# EAGLE design hot-wand-lite (EAGLE 7.6.0)
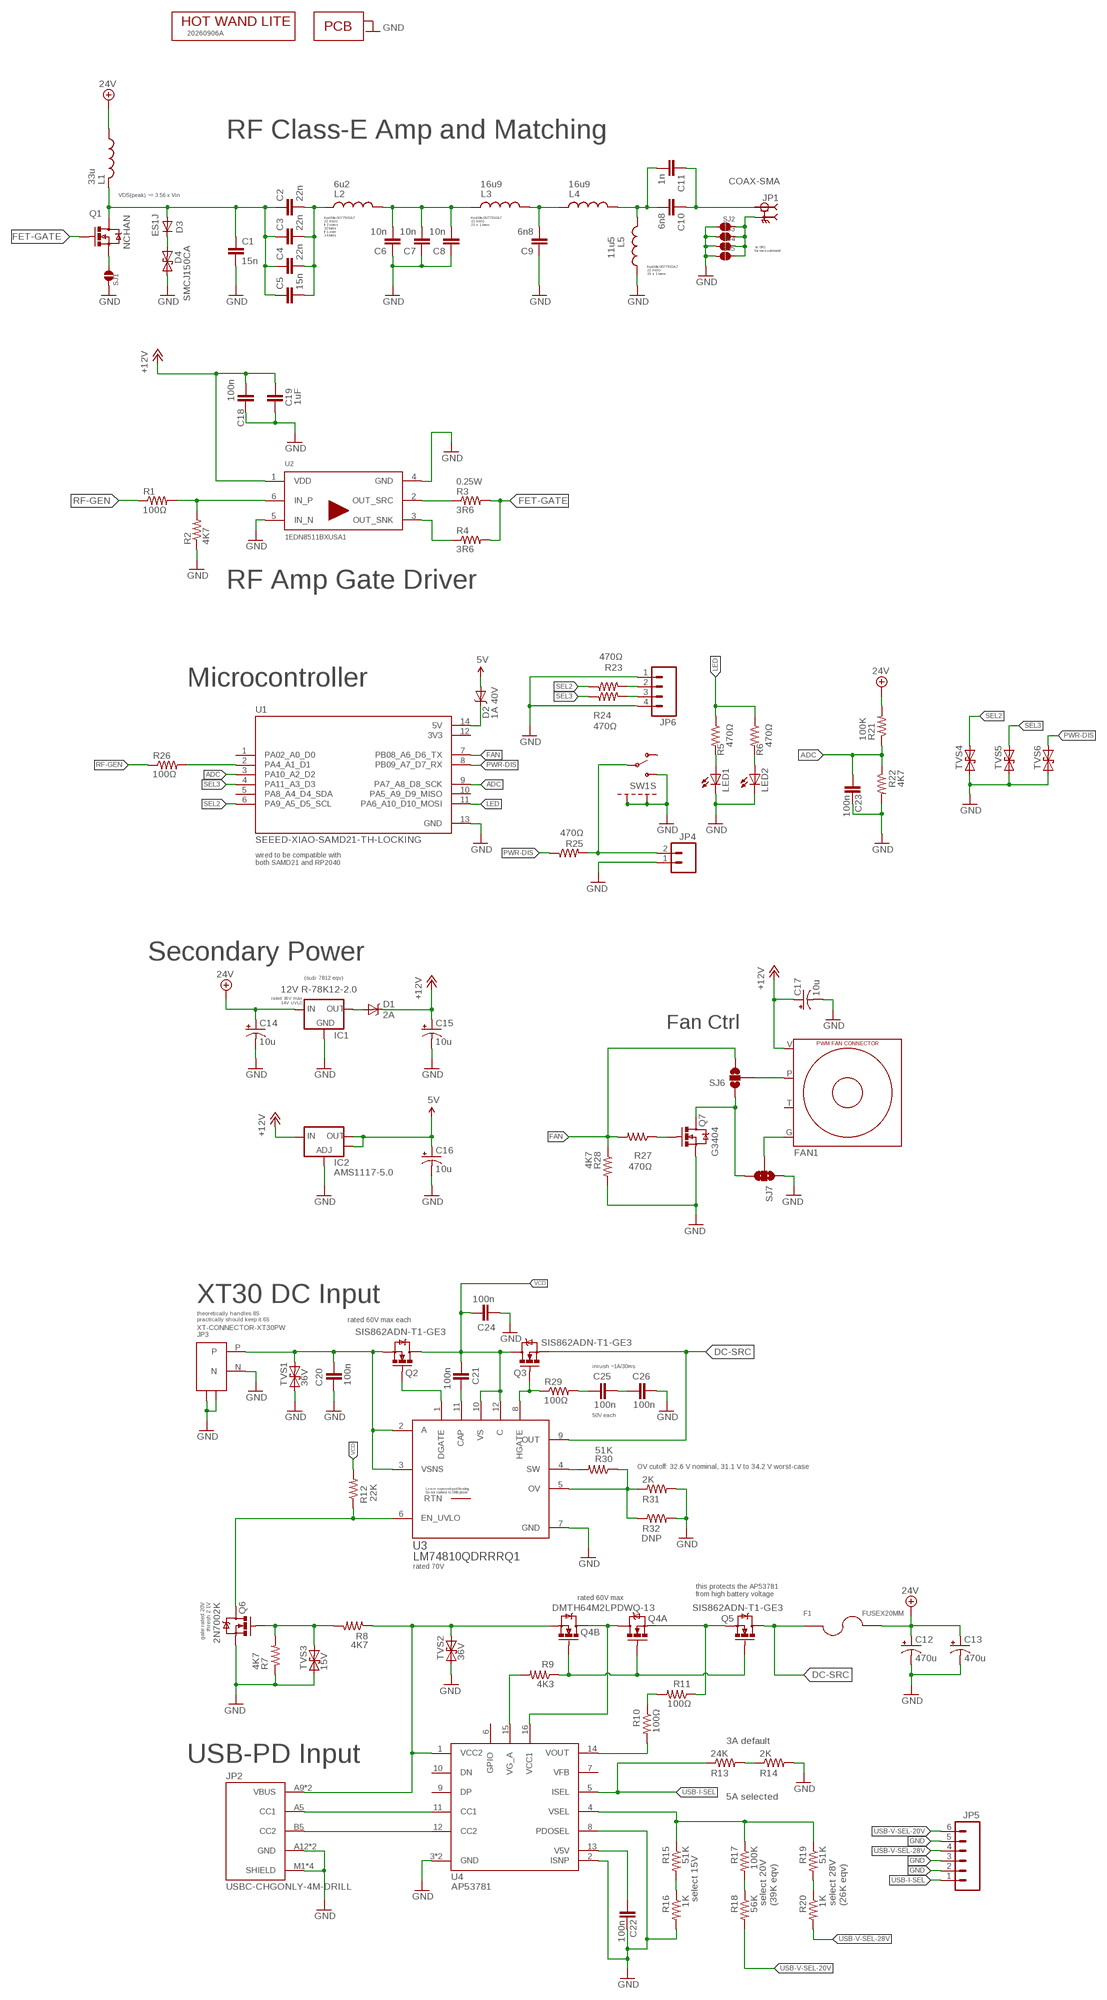
[diagram p0: schematic, sheet 1]

## Parts
C1  15n  CAP1206  [1206]
C2  22n  CAP1206  [1206]
C3  22n  CAP1206  [1206]
C4  22n  CAP1206  [1206]
C5  15n  CAP1206  [1206]
C6  10n  CAP1206  [1206]
C7  10n  CAP1206  [1206]
C8  10n  CAP1206  [1206]
C9  6n8  CAP1206  [1206]
C10  6n8  CAP1206  [1206]
C11  1n  CAP1206  [1206]
C12  470u  CAP_POLPTH5  [CPOL-RADIAL-COMBO-10MM]
C13  470u  CAP_POLPTH5  [CPOL-RADIAL-COMBO-10MM]
C14  10u  CAP_POL1206-KIT  [EIA3216-KIT]
C15  10u  CAP_POL1206-KIT  [EIA3216-KIT]
C16  10u  CAP_POL1206-KIT  [EIA3216-KIT]
C17  10u  CAP_POL1206-KIT  [EIA3216-KIT]
C18  100n  CAP0603-CAP  [0603-CAP]
C19  1uF  CAP0603-CAP  [0603-CAP]
C20  100n  CAP0603-CAP  [0603-CAP]
C21  100n  CAP0603-CAP  [0603-CAP]
C22  100n  CAP0603-CAP  [0603-CAP]
C23  100n  CAP0603-CAP  [0603-CAP]
C24  100n  CAP0603-CAP  [0603-CAP]
C25  100n  CAP0603-CAP  [0603-CAP]
C26  100n  CAP0603-CAP  [0603-CAP]
D1  2A  DIODE-SCHOTTKY_  [SMA-DIODE]
D2  1A 40V  DIODE-SCHOTTKYSOD123FL  [SOD123FL]
D3  ES1J  DIODESMA  [SMA-DIODE]
D4  SMCJ150CA  TVSSMC  [SMC]
F1  FUSEX20MM  [FUSE_5MM]
FAN1  FAN-CONN-X4-CONN-X4  [FAN-CONN-X4]
IC1  12V R-78K12-2.0  V_REG_78XX-BUCK  [TO220-BUCK-12V]
IC2  AMS1117-5.0  V_REG_LM1117SOT223  [SOT223]
JP1  COAX-SMA  COAX-SMA-EDGE-LGRPAD  [SAMTEC_SMA-J-P-H-ST-EM1-LGRPAD]
JP2  USBC-CHGONLY-4M-DRILL  [SAMESKY_UJC-H-G-SMT-2-P6-TR-DRILL]
JP3  XT-CONNECTOR-XT30PW  [XT30PW]
JP4  M02PTH3  [1X02_LONGPADS]
JP5  M06LOCK  [1X06_LOCK]
JP6  M04LOCK  [1X04_LOCK]
L1  33u  INDUCTOR-SRP1265A  [IND_SRP1265A]
L2  6u2  INDUCTOR-KOOLMU-2W  [IND-KOOLMU-2W]
L3  16u9  INDUCTOR-KOOLMU  [IND-KOOLMU]
L4  16u9  INDUCTOR-KOOLMU  [IND-KOOLMU]
L5  11u5  INDUCTOR-KOOLMU  [IND-KOOLMU]
LED1  LED  LED-LTST-S220KRKT  [LED_LTST-S220KRKT]
LED2  LED  LED0603  [LED-0603]
PCB1  PCB-OUTLINE  [PCB-OUTLINE]
PCB2  PCB-ART-VER-LITE  [PCB-ART-VERSION-LITE]
Q1  NCHAN  MOSFET-NCHANNEL-TO247-COMBO  [TO247-COMBO]
Q2  SIS862ADN-T1-GE3  MOSFET-NCHANNEL-POWERPAK1212-8  [POWERPAK-1212-8]
Q3  SIS862ADN-T1-GE3  MOSFET-NCHANNEL-POWERPAK1212-8  [POWERPAK-1212-8]
Q4  DMTH64M2LPDWQ-13  MOSFET-NCHAN-X2-PPSO8X2  [POWERPAK-SO8-X2]
Q5  SIS862ADN-T1-GE3  MOSFET-NCHANNEL-POWERPAK1212-8  [POWERPAK-1212-8]
Q6  2N7002K  MOSFET-NCHANNELSMD  [SOT23-3]
Q7  G3404  MOSFET-NCHANNELSMD  [SOT23-3]
R1  100Ω  RESISTOR0805-RES  [0805]
R2  4K7  RESISTOR0603-RES  [0603-RES]
R3  3R6  RESISTOR0603-RES  [0603-RES]
R4  3R6  RESISTOR0603-RES  [0603-RES]
R5  470Ω  RESISTOR0603-RES  [0603-RES]
R6  470Ω  RESISTOR0603-RES  [0603-RES]
R7  4K7  RESISTOR0603-RES  [0603-RES]
R8  4K7  RESISTOR0603-RES  [0603-RES]
R9  4K3  RESISTOR0603-RES  [0603-RES]
R10  100Ω  RESISTOR0805-RES  [0805]
R11  100Ω  RESISTOR0805-RES  [0805]
R12  22K  RESISTOR0603-RES  [0603-RES]
R13  24K  RESISTOR0603-RES  [0603-RES]
R14  2K  RESISTOR0603-RES  [0603-RES]
R15  51K  RESISTOR0603-RES  [0603-RES]
R16  1K  RESISTOR0603-RES  [0603-RES]
R17  100K  RESISTOR0603-RES  [0603-RES]
R18  56K  RESISTOR0603-RES  [0603-RES]
R19  51K  RESISTOR0603-RES  [0603-RES]
R20  1K  RESISTOR0603-RES  [0603-RES]
R21  100K  RESISTOR0603-RES  [0603-RES]
R22  4K7  RESISTOR0603-RES  [0603-RES]
R23  470Ω  RESISTOR0603-RES  [0603-RES]
R24  470Ω  RESISTOR0603-RES  [0603-RES]
R25  470Ω  RESISTOR0603-RES  [0603-RES]
R26  100Ω  RESISTOR0805-RES  [0805]
R27  470Ω  RESISTOR0603-RES  [0603-RES]
R28  4K7  RESISTOR0603-RES  [0603-RES]
R29  100Ω  RESISTOR0805-RES  [0805]
R30  51K  RESISTOR0603-RES  [0603-RES]
R31  2K  RESISTOR0603-RES  [0603-RES]
R32  DNP  RESISTOR0603-RES  [0603-RES]
SJ1  SJ-SMALL-1206-SJ  [1206-SJ]
SJ2  SJ-SMALL-1206-SJ  [1206-SJ]
SJ3  SJ-SMALL-1206-SJ  [1206-SJ]
SJ4  SJ-SMALL-1206-SJ  [1206-SJ]
SJ5  SJ-SMALL-1206-SJ  [1206-SJ]
SJ6  SOLDERJUMPER_2WAYS  [SJ_3]
SJ7  SOLDERJUMPER_2WAYS  [SJ_3]
SW1  SWITCH-SPDT-2MNT-SLW-864574-5A-RA-N-D  [SWITCH-SLW-864574-5A-RA-N-D]
TVS1  36V  TVSSMA  [SMA]
TVS2  36V  TVSSMA  [SMA]
TVS3  15V  TVSSOD-323  [SOD-323]
TVS4  TVSSOD323-R  [SOD323-R]
TVS5  TVSSOD323-R  [SOD323-R]
TVS6  TVSSOD323-R  [SOD323-R]
U1  SEEED-XIAO-SAMD21-TH-LOCKING  [MODULE_102010388_LOCKING]
U2  1EDN8511BXUSA1  1EDN8511B  [SOT95P280X145-6N-7-V]
U3  LM74810QDRRRQ1  [DRR0012E-MFG]
U4  AP53781  AP53781-QFN3030-16  [QFN3030-16]

## Nets
5V: C16.A(+) D2.A IC2.2(OUT) IC2.4(OUT)
12V-2: D1.A IC1.3(OUT)
+12V: C15.A(+) C17.A(+) C18.2 C19.2 D1.C FAN1.V IC2.3(IN) U2.1(VDD)
+24V: C12.1(+) C12.1B(+) C13.1(+) C13.1B(+) C14.A(+) F1.3 F1.4 IC1.1(IN) L1.1 R21.2 ; supply symbol labelled 24V
ADC: C23.2 R21.1 R22.1 U1.3(PA10_A2_D2) U1.9(PA7_A8_D8_SCK)
DC-SRC: F1.1 F1.2 Q3.1(S) Q3.2(S) Q3.3(S) Q5.5(D) Q5.6(D) Q5.7(D) Q5.8(D) Q5.9(D) U3.9(OUT)
FAN: R27.2 R28.1 SJ6.3 U1.7(PB08_A6_D6_TX)
FET-GATE: Q1.1(G) Q1.1B(G) R3.2 R4.2
GND: C1.2 C6.1 C7.1 C8.1 C9.1 C12.2(-) C12.2B(-) C13.2(-) C13.2B(-) C14.C(-) C15.C(-) C16.C(-) C17.C(-) C18.1 C19.1 C20.2 C22.1 C23.1 C24.2 C26.1 D4.A IC1.2(GND) IC2.1(ADJ) JP2.A12(GND) JP2.B12(GND) JP2.M1(SHIELD) JP2.M2(SHIELD) JP2.M3(SHIELD) JP2.M4(SHIELD) JP3.M1 JP3.M2 JP3.N JP4.1 JP5.2 JP5.3 JP5.5 JP6.1 JP6.4 L5.1 LED1.C LED2.C PCB1.1 PCB1.2 PCB1.3 PCB1.4 Q6.2(S) Q7.2(S) R2.1 R7.1 R14.2 R16.2 R22.2 R28.2 R31.2 R32.2 SJ1.1 SJ2.2 SJ3.2 SJ4.2 SJ5.2 SJ7.1 SW1.M1(M:MNT1) SW1.M2(M:MNT2) SW1.R(S:S) TVS1.A TVS2.A TVS3.2 TVS4.A TVS5.A TVS6.A U1.13(GND) U2.4(GND) U2.5(IN_N) U3.7(GND) U4.2(ISNP) U4.3(GND) U4.8(PDOSEL) U4.EXP(GND)
LED: R5.1 R6.1 U1.11(PA6_A10_D10_MOSI)
M1: C2.2 C3.2 C4.2 C5.2 L2.1A L2.1B L2.1C L2.1D
M2: C6.2 C7.2 C8.2 L2.2A L2.2B L2.2C L2.2D L3.1
M3: C9.2 L3.2 L4.1
M4: C10.2 C11.2 L4.2 L5.2
MCU-RF: R1.2 R2.2 U2.6(IN_P)
MOSFET-DRAIN: C1.1 C2.1 C3.1 C4.1 C5.1 D3.A L1.2 Q1.2(D)
MOSFET-SOURCE: Q1.3(S) Q1.3B(S) SJ1.2
N$2: R17.2 R18.1
N$3: SW1.L(S:O)
N$8: LED2.A R6.2
N$9: R15.2 R16.1
N$10: R13.2 R14.1
N$13: R19.2 R20.1
N$14: R3.1 U2.2(OUT_SRC)
N$15: R4.1 U2.3(OUT_SNK)
N$16: Q4.1(A:S) Q5.1(S) Q5.2(S) Q5.3(S) R11.1
N$17: JP6.2 R23.2
N$18: JP6.3 R24.2
N$19: Q7.1(G) R27.1
N$20: FAN1.P SJ6.2
N$21: JP4.2 R25.2 SW1.C(S:P)
N$22: Q7.3(D) SJ6.1 SJ7.3
N$23: D2.C U1.14(5V)
N$24: FAN1.G SJ7.2
N$25: D3.C D4.C
N$29: C25.1 C26.2
N$30: Q6.1(G) R7.2 R8.2 TVS3.1
N$35: Q4.5(B:D) Q4.6(B:D) Q4.7(A:D) Q4.8(A:D) Q4.9(B:D) Q4.10(A:D) U4.16(VCC1)
N$38: C22.2 U4.13(V5V)
N$40: R10.2 U4.14(VOUT)
N$43: C25.2 R29.2
N$46: LED1.A R5.2
N$57: R10.1 R11.2
N$68: R30.2 U3.4(SW)
N$69: C21.1 U3.11(CAP)
PWR-DIS: R25.1 TVS6.C U1.8(PB09_A7_D7_RX)
RF-GEN: R1.1 R26.1
RF-GEN-PRE: R26.2 U1.2(PA4_A1_D1)
RF-OUT: C10.1 C11.1 JP1.1
RF-RETURN: JP1.2_1 JP1.2_2 JP1.3_1 JP1.3_2 SJ2.1 SJ3.1 SJ4.1 SJ5.1
SEL2: R23.1 TVS4.C U1.6(PA9_A5_D5_SCL)
SEL3: R24.1 TVS5.C U1.4(PA11_A3_D3)
U3-DGATE: Q2.4(G) U3.1(DGATE)
U3-EN: Q6.3(D) R12.1 U3.6(EN_UVLO)
U3-HGATE: Q3.4(G) R29.1 U3.8(HGATE)
U3-OV: R30.1 R31.1 R32.1 U3.5(OV)
U4-VGA: R9.2 U4.15(VG_A)
U4-VGA-2: Q4.2(A:G) Q4.4(B:G) Q5.4(G) R9.1
U4-VSEL: R15.1 R17.1 R19.1 U4.4(VSEL)
USB-CC1: JP2.A5(CC1) U4.11(CC1)
USB-CC2: JP2.B5(CC2) U4.12(CC2)
USB-I-SEL: JP5.1 R13.1 U4.5(ISEL)
USB-V-SEL-20V: JP5.6 R18.2
USB-V-SEL-28V: JP5.4 R20.2
USB-VBUS: JP2.A9(VBUS) JP2.B9(VBUS) Q4.3(B:S) R8.1 TVS2.C U4.1(VCC2)
VCD: C21.2 C24.1 Q2.5(D) Q2.6(D) Q2.7(D) Q2.8(D) Q2.9(D) Q3.5(D) Q3.6(D) Q3.7(D) Q3.8(D) Q3.9(D) R12.2 U3.10(VS) U3.12(C)
VIN-XT30: C20.1 JP3.P Q2.1(S) Q2.2(S) Q2.3(S) TVS1.C U3.2(A) U3.3(VSNS)
Unconnected: FAN1.T U1.1(PA02_A0_D0) U1.5(PA8_A4_D4_SDA) U1.10(PA5_A9_D9_MISO) U3.13(RTN) U4.6(GPIO) U4.7(VFB) U4.9(DP) U4.10(DN)

## Notes on the sheet
- RF Class-E Amp and Matching
- VDS(peak) ~= 3.56 x Vin
- Kool Mu 0077932A7
  22 AWG
  if 2 cores
  10 turns
  if 1 core
  14 turns
- Kool Mu 0077932A7
  22 AWG
  23 ± 1 turns
- 4x 0R1
  for measurement
- Kool Mu 0077932A7
  22 AWG
  19 ± 1 turns
- 0.25W
- RF Amp Gate Driver
- Microcontroller
- wired to be compatible with
  both SAMD21 and RP2040
- Secondary Power
- (sub: 7812 eqv)
- rated 36V max
  14V UVLO
- Fan Ctrl
- XT30 DC Input
- theoretically handles 8S
  practically should keep it 6S
- rated 60V max each
- inrush ~1A/30ms
- 50V each
- OV cutoff: 32.6 V nominal, 31.1 V to 34.2 V worst-case
- rated 70V
- this protects the AP53781
  from high battery voltage
- rated 60V max
- gate rated 20V
  thresh 2.1V
- 3A default
- USB-PD Input
- 5A selected
- select 15V
- select 20V
  (39K eqv)
- select 28V
  (26K eqv)

## Power pins joined to a net without a drawn wire
3V3: U1.12(3V3)

## Library data of the parts
C1 C5 = hot-wand:CAP: Capacitor Standard 0603 ceramic capacitor, and 0.1" leaded capacitor.; JLCPARTNUM: C3858208; PARTNUM: C3216C0G2E153J160AA
C2 C3 = hot-wand:CAP: Capacitor Standard 0603 ceramic capacitor, and 0.1" leaded capacitor.; JLCPARTNUM: C3862155
C4 = hot-wand:CAP: Capacitor Standard 0603 ceramic capacitor, and 0.1" leaded capacitor.; JLCPARTNUM: C3862155; PARTNUM: GCM31C5C2E223JX03L
C6 = hot-wand:CAP: Capacitor Standard 0603 ceramic capacitor, and 0.1" leaded capacitor.; JLCPARTNUM: C2261646;C2170837;C2175075; PARTNUM: C3216C0G2E103J115AA
C7 C8 = hot-wand:CAP: Capacitor Standard 0603 ceramic capacitor, and 0.1" leaded capacitor.; JLCPARTNUM: C2261646; PARTNUM: GRM31B5C2E103JWA1L
C9 C10 = hot-wand:CAP: Capacitor Standard 0603 ceramic capacitor, and 0.1" leaded capacitor.; JLCPARTNUM: C2182121; PARTNUM: C1206C682JCGACAUTO
C11 = hot-wand:CAP: Capacitor Standard 0603 ceramic capacitor, and 0.1" leaded capacitor.; JLCPARTNUM: C3859218; PARTNUM: GCM31C5C3A102FX03L
C12 C13 = hot-wand:CAP_POL: Capacitor Polarized These are standard SMD and PTH capacitors. Normally 10uF, 47uF, and 100uF in electrolytic and tantalum varieties. Always verify the external diameter of the through hole cap, it varies with capacity, voltage, and manufacturer. The EIA devices should be standard.; JLC-DNP: 1; PARTNUM: UHW1H471MPD
C14 C17 = hot-wand:CAP_POL: Capacitor Polarized These are standard SMD and PTH capacitors. Normally 10uF, 47uF, and 100uF in electrolytic and tantalum varieties. Always verify the external diameter of the through hole cap, it varies with capacity, voltage, and manufacturer. The EIA devices should be standard.; JLCPARTNUM: C13585; PARTNUM: MLASU31LBB5106KTNA01;GRT31CR61H106KE01K
C15 C16 = hot-wand:CAP_POL: Capacitor Polarized These are standard SMD and PTH capacitors. Normally 10uF, 47uF, and 100uF in electrolytic and tantalum varieties. Always verify the external diameter of the through hole cap, it varies with capacity, voltage, and manufacturer. The EIA devices should be standard.; JLCPARTNUM: C13585; PARTNUM: TAJA106K016TNJ;T491A106K016AT
C18 C20-C26 = hot-wand:CAP: Capacitor Standard 0603 ceramic capacitor, and 0.1" leaded capacitor.; JLCPARTNUM: C14663
C19 = hot-wand:CAP: Capacitor Standard 0603 ceramic capacitor, and 0.1" leaded capacitor.; JLCPARTNUM: C15849
D1 = hot-wand:DIODE-SCHOTTKY; JLCPARTNUM: C698873; JLC_ROTATION: 180; PARTNUM: VSSAF5N50;SL36A
D2 = hot-wand:DIODE-SCHOTTKY; JLCPARTNUM: C8598
D3 = hot-wand:DIODE: Diode These are standard reverse protection diodes and small signal diodes. SMA package can handle up to about 1A. SOD-323 can handle about 200mA. What the SOD-323 package when ordering, there are some mfgs out there that are 5-pin packages.; JLCPARTNUM: C64879; JLC_ROTATION: 180
D4 = hot-wand:TVS; JLCPARTNUM: C2649864
F1 = hot-wand:FUSE; JLC-DNP: 1; PARTNUM: 3518P
FAN1 = hot-wand:FAN-CONN-X4; PARTNUM: 0470531000
IC1 = hot-wand:V_REG_78XX: Voltage Regulator Standard 7805 5V regulator. IGO (Input Ground Output). Spark Fun Electronics SKU : COM-00107; JLC-DNP: 1; PARTNUM: R-78K12-2.0
IC2 = hot-wand:V_REG_LM1117: Voltage Regulator LM1117 Standard adjustable voltage regulator but in SMD form. Spark Fun Electronics SKU : COM-00595; JLCPARTNUM: C6187; PARTNUM: AMS1117-5.0
JP1 = hot-wand:COAX-SMA: Check availability <https://pricing.snapeda.com/parts/SMA-J-P-H-ST-EM1/Samtec/view-part?ref=eda>; AVAILABILITY: In Stock; CHECK_PRICES: https://www.snapeda.com/parts/SMA-J-P-H-ST-EM1/Samtec+Inc./view-part/?ref=eda; DESCRIPTION: SMA Connector Jack, Female Socket 50 Ohms Board Edge, End Launch Solder; JLC-DNP: 1; MF: Samtec; MP: SMA-J-P-H-ST-EM1; PACKAGE: None; PARTNUM: SMA-J-P-H-ST-EM1; PRICE: None; PURCHASE-URL: https://www.snapeda.com/api/url_track_click_mouser/?unipart_id=134500&manufacturer=Samtec&part_name=SMA-J-P-H-ST-EM1&search_term=sma-j-p-h-st-em1; SNAPEDA_LINK: https://www.snapeda.com/parts/SMA-J-P-H-ST-EM1/Samtec+Inc./view-part/?ref=snap
JP2 = hot-wand:USBC-CHGONLY-4M; CHECK_PRICES: https://www.snapeda.com/parts/UJC-H-G-SMT-2-P6-TR/Same+Sky/view-part/?ref=eda; DESCRIPTION: Type C, Power Only, 30 Vac, 3 A, Horizontal, Gold plated 1u, Surface Mount,6 pin, USB Receptacle; DIGIKEY_PART_NUMBER: 2223-UJC-H-G-SMT-2-P6-TRCT-ND; JLC-DNP: 1; MF: Same Sky; MP: UJC-H-G-SMT-2-P6-TR; PACKAGE: None; PARTNUM: UJC-H-G-SMT-P6-TR; SNAPEDA_LINK: https://www.snapeda.com/parts/UJC-H-G-SMT-2-P6-TR/Same+Sky/view-part/?ref=snap
JP3 = hot-wand:XT-CONNECTOR; JLC-DNP: 1; PARTNUM: XT30PW-M
JP4 = hot-wand:M02: Header 2 Standard 2-pin 0.1" header. Use with straight break away headers (SKU : PRT-00116), right angle break away headers (PRT-00553), swiss pins (PRT-00743), machine pins (PRT-00117), and female headers (PRT-00115). Molex polarized connector foot print use with SKU : PRT-08233 with associated crimp pins and housings.; JLC-DNP: 1
JP5 = hot-wand:M06: Header 6 Standard 6-pin 0.1" header. Use with straight break away headers (SKU : PRT-00116), right angle break away headers (PRT-00553), swiss pins (PRT-00743), machine pins (PRT-00117), and female headers (PRT-00115). Molex polarized connector foot print use with SKU : PRT-08094 with associated crimp pins and housings. NOTES ON THE VARIANTS LOCK and LOCK_LONGPADS... This footprint was designed to help hold the alignment of a through-hole component (i.e. 6-pin header) while soldering it into place. You may notice that each hole has been shifted either up or down by 0.005 of an inch from it's more standard position (which is a perfectly straight line). This slight alteration caused the pins (the squares in the middle) to touch the edges of the holes. Because they are alternating, it causes a "brace" to hold the component in place. 0.005 has proven to be the perfect amount of "off-center" position when using our standard breakaway headers. Although looks a little odd when you look at the bare footprint, once you have a header in there, the alteration is very hard to notice. Also, if you push a header all the way into place, it is covered up entirely on the bottom side. This idea of altering the position of holes to aid alignment will be further integrated into the Sparkfun Library for other footprints. It can help hold any component with 3 or more connection pins.
JP6 = hot-wand:M04: Header 4 Standard 4-pin 0.1" header. Use with straight break away headers (SKU : PRT-00116), right angle break away headers (PRT-00553), swiss pins (PRT-00743), machine pins (PRT-00117), and female headers (PRT-00115). Molex polarized connector foot print use with SKU : PRT-08231 with associated crimp pins and housings. 1MM SMD Version SKU: PRT-10208; JLC-DNP: 1
L1 = hot-wand:INDUCTOR: Inductors Basic Inductor/Choke - 0603 and 1206. Footprints are not proven and vary greatly between part numbers.; JLCPARTNUM: C2453886; PARTNUM: PA4343.333NLT;SRP1265A-330M;SRP1265CC-330M
L2-L5 = hot-wand:INDUCTOR: Inductors Basic Inductor/Choke - 0603 and 1206. Footprints are not proven and vary greatly between part numbers.; JLC-DNP: 1
LED1 = hot-wand:LED: LEDs Standard schematic elements and footprints for 5mm, 3mm, 1206, and 0603 sized LEDs. 5mm - Spark Fun Electronics SKU : COM-00529 (and others); JLCPARTNUM: C284935; PARTNUM: LTST-S220KRKT
LED2 = hot-wand:LED: LEDs Standard schematic elements and footprints for 5mm, 3mm, 1206, and 0603 sized LEDs. 5mm - Spark Fun Electronics SKU : COM-00529 (and others); JLC-DNP: 1
PCB1 = hot-wand:PCB-OUTLINE; DNP: 1; JLC-DNP: 1
PCB2 = hot-wand:PCB-ART-VER-LITE; DNP: 1; JLC-DNP: 1
Q1 = hot-wand:MOSFET-NCHANNEL; JLC-DNP: 1
Q2 Q3 Q5 = hot-wand:MOSFET-NCHANNEL; JLC-DNP: 1; PARTNUM: SIS862ADN-T1-GE3
Q4 = hot-wand:MOSFET-NCHAN-X2; JLC-DNP: 1; PARTNUM: DMTH64M2LPDWQ-13
Q6 = hot-wand:MOSFET-NCHANNEL; JLCPARTNUM: C14498;C547263;C5224211;C54347659; PARTNUM: 2N7002K;SSM3K388R,LF;Si2318CDS-T1-GE3;PMV60ENEAR
Q7 = hot-wand:MOSFET-NCHANNEL; JLCPARTNUM: C14498;C547263;C96615; PARTNUM: G3404;MMFTN3404A;PJA3404A;Si2318CDS-T1-GE3;PMV60ENEAR
R1 R10 R11 R26 R29 = hot-wand:RESISTOR: Resistor Basic schematic elements and footprints for 0603, 1206, and PTH resistors.; JLCPARTNUM: C441975
R2 R7 R8 R22 R28 = hot-wand:RESISTOR: Resistor Basic schematic elements and footprints for 0603, 1206, and PTH resistors.; JLCPARTNUM: C23162
R3 R4 = hot-wand:RESISTOR: Resistor Basic schematic elements and footprints for 0603, 1206, and PTH resistors.; JLCPARTNUM: C445783
R5 R6 R23-R25 R27 = hot-wand:RESISTOR: Resistor Basic schematic elements and footprints for 0603, 1206, and PTH resistors.; JLCPARTNUM: C23179
R9 = hot-wand:RESISTOR: Resistor Basic schematic elements and footprints for 0603, 1206, and PTH resistors.; JLCPARTNUM: C23159
R12 = hot-wand:RESISTOR: Resistor Basic schematic elements and footprints for 0603, 1206, and PTH resistors.; JLCPARTNUM: C31850
R13 = hot-wand:RESISTOR: Resistor Basic schematic elements and footprints for 0603, 1206, and PTH resistors.; JLCPARTNUM: C23352
R14 R31 = hot-wand:RESISTOR: Resistor Basic schematic elements and footprints for 0603, 1206, and PTH resistors.; JLCPARTNUM: C22975
R15 R19 R30 = hot-wand:RESISTOR: Resistor Basic schematic elements and footprints for 0603, 1206, and PTH resistors.; JLCPARTNUM: C23196
R16 R20 = hot-wand:RESISTOR: Resistor Basic schematic elements and footprints for 0603, 1206, and PTH resistors.; JLCPARTNUM: C21190
R17 R21 = hot-wand:RESISTOR: Resistor Basic schematic elements and footprints for 0603, 1206, and PTH resistors.; JLCPARTNUM: C25803
R18 = hot-wand:RESISTOR: Resistor Basic schematic elements and footprints for 0603, 1206, and PTH resistors.; JLCPARTNUM: C23206
R32 = hot-wand:RESISTOR: Resistor Basic schematic elements and footprints for 0603, 1206, and PTH resistors.; DNP: 1
SJ1-SJ5 = hot-wand:SJ-SMALL
SJ6 SJ7 = hot-wand:SOLDERJUMPER_2WAY: Solder Jumper 2 way solder jumper
SW1 = hot-wand:SWITCH-SPDT-2MNT; JLC-DNP: 1; PARTNUM: SLW-864574-5A-RA-N-D
TVS1 TVS2 = hot-wand:TVS; JLCPARTNUM: C134984; PARTNUM: SMAJ36CA
TVS3 = hot-wand:TVS; JLCPARTNUM: C2987151; PARTNUM: SD15C-01FTG;CDSOD323-T15SC;TSD15CDYFR
TVS4-TVS6 = hot-wand:TVS; JLCPARTNUM: C840638
U1 = hot-wand:SEEED-XIAO-SAMD21: Check availability <https://pricing.snapeda.com/parts/102010388/seeed%20technology%20limited/view-part?ref=eda>; AVAILABILITY: In Stock; CHECK_PRICES: https://www.snapeda.com/parts/102010388/Seeed+Studio/view-part/?ref=eda; DESCRIPTION: ATSAMD21G18 XIAO SAMD21 SAM D ARM® Cortex®-M0 MCU 32-Bit Embedded Evaluation Board; JLC-DNP: 1; MF: seeed technology limited; MP: 102010388; PACKAGE: None; PRICE: None; PURCHASE-URL: https://www.snapeda.com/api/url_track_click_mouser/?unipart_id=7601083&manufacturer=seeed technology limited&part_name=102010388&search_term=xiao samd21; SNAPEDA_LINK: https://www.snapeda.com/parts/102010388/Seeed+Studio/view-part/?ref=snap
U2 = hot-wand:1EDN8511B: 1EDN8511B SOT95P280X145-6N-7-V EiceDRIVER, Fast Single Channel 4A/8A Low-Side Gate Driver, UVLO - 8V; JLCPARTNUM: C3655509; JLC_ROTATION: 180
U3 = hot-wand:LM74810QDRRRQ1; COPYRIGHT: Copyright (C) 2026 Ultra Librarian. All rights reserved.; DATASHEET: https://www.ti.com/lit/gpn/lm7481-q1; DESCRIPTION: Automotive ideal diode controller with active rectification driving B2B NFETs 12-WSON -40 to 125; JLCPARTNUM: C3215601; MANUFACTURER_NAME: Texas Instruments; MANUFACTURER_PART_NUMBER: LM74810QDRRRQ1; REFDES: RefDes; TYPE: TYPE
U4 = hot-wand:AP53781; JLCPARTNUM: C52730979; JLC_ROTATION: 270

## Board
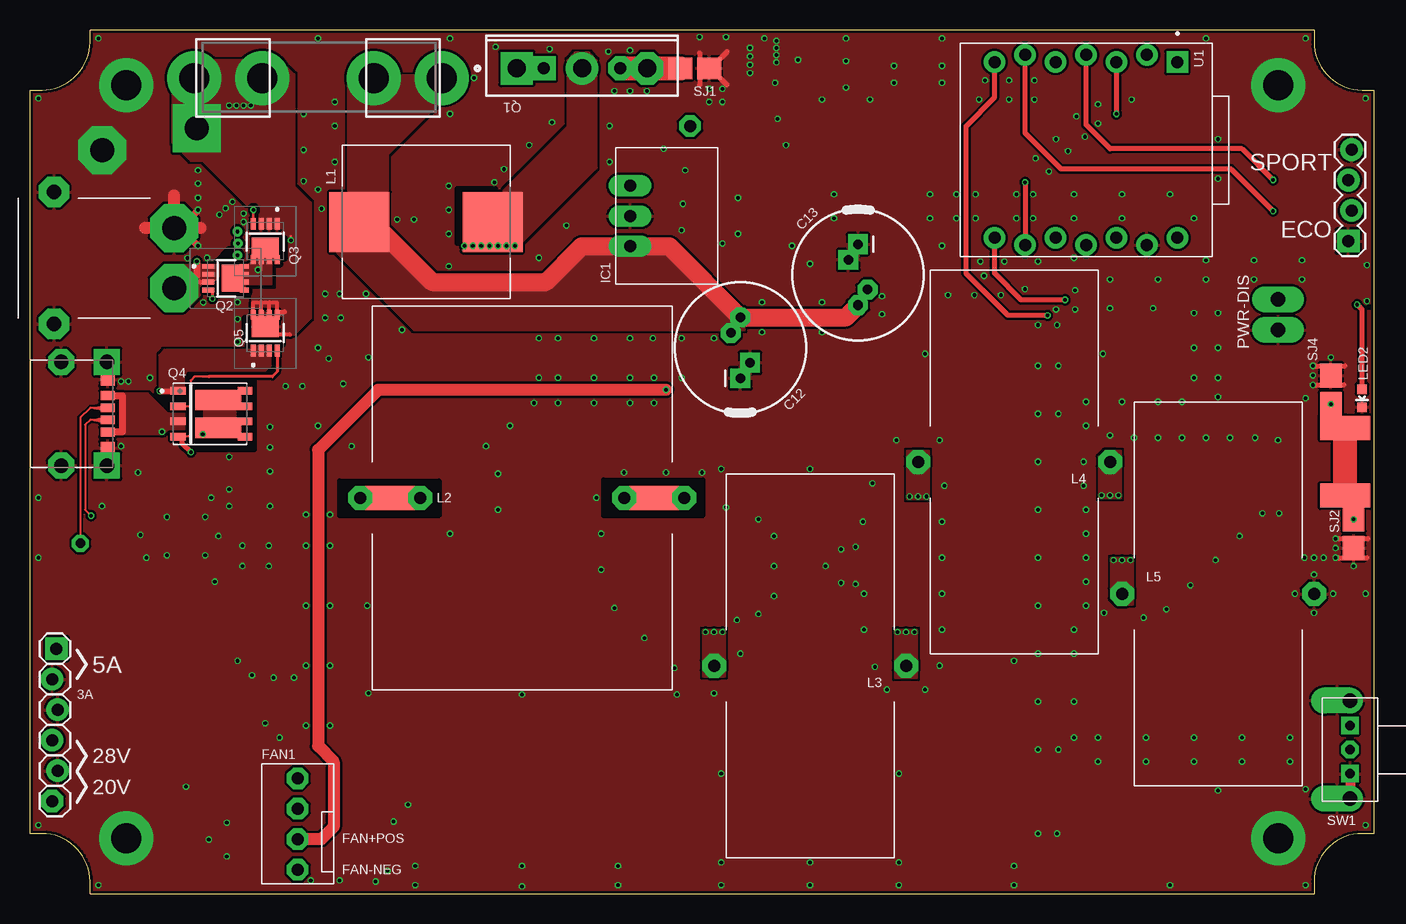
[diagram p1: board, top side]
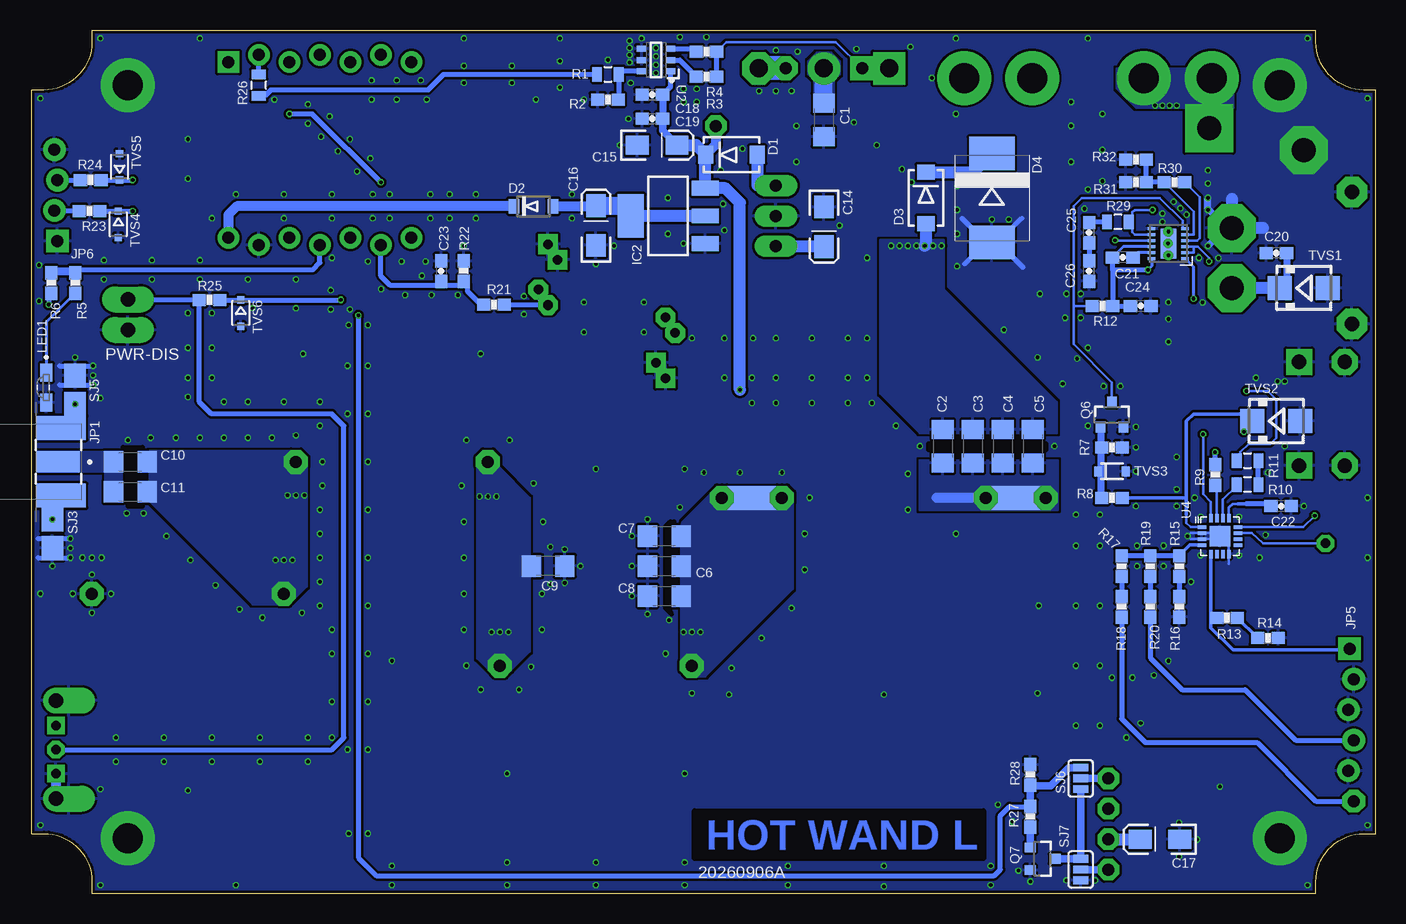
[diagram p2: board, bottom side, seen from below]

Size 112 x 72 mm. Coordinates in mm from the lower left corner, seen from the top.
Copper layers (1*16): Top 0.035mm / dielectric 1.6mm / Bottom 0.035mm
Design rules "jlcpcb-2layers": minimum track width 5mil, minimum drill 0.3mm, track to track 5mil, track to pad 5mil, pad to pad 5mil, via to via 5mil, smd to smd 5mil, copper to edge 0.2mm, drill to drill 6mil, minimum pad ring 10mil, minimum via ring 4mil, stop-mask expansion 4mil, vias tented up to drill 0.5mm, thermal gap 8mil
tRestrict: 19 lines
bRestrict: 8 lines

### Footprints (pad centres in the part's own frame; a part is rotated, then mirrored left to right if it is on the bottom)
1206 = smd 1.6 x 1.8: 1 -1.4,0; 2 1.4,0
CPOL-RADIAL-COMBO-10MM = drill 0.8 pad 1.651 octagon: 1 2.54,0; 1B 1.24,0.8 | drill 0.8 pad 1.651 square: 2 -2.54,0; 2B -1.24,-0.8
EIA3216-KIT = smd 1.9 x 1.6: A 1.65,0; C -1.65,0
0603-CAP = smd 1.1 x 1: 1 -0.85,0; 2 0.85,0
SMA-DIODE = smd 1.27 x 1.47: A -2.15,0; C 2.15,0
SOD123FL = smd 0.91 x 1.22: A 1.625,0; C -1.625,0
SMC = smd 2.8 x 3.8: A 3.7,0; C -3.7,0
FUSE_5MM = drill 2.5 pad 3.556: 1 0,-10.3; 2 0,-4.658; 3 0,4.658; 4 0,10.3
FAN-CONN-X4 = drill 1 octagon: G 0,3.8; P 0,-3.8; T 0,-1.27; V 0,1.27
TO220-BUCK-12V = drill 1 long: 1 -2.54,0; 2 0,0; 3 2.54,0
SOT223 = smd 1.219 x 2.235: 1 -2.311,-3.099; 2 0,-3.099; 3 2.311,-3.099 | smd 3.6 x 2.2: 4 0,3.099
SAMTEC_SMA-J-P-H-ST-EM1-LGRPAD = smd 1.8 x 3.6: 1 0,0 | smd 2 x 4.2: 2_1 -2.825,0.2; 3_1 2.825,0.2 | smd 2 x 4.2 bottom: 2_2 -2.825,0.2; 3_2 2.825,0.2
SAMESKY_UJC-H-G-SMT-2-P6-TR-DRILL = smd 0.7 x 1.2: A5 -0.5,3.88; B5 0.5,3.88 | smd 0.76 x 1.2: A9 1.52,3.88; B9 -1.52,3.88 | smd 1 x 1.2: A12 2.85,3.88; B12 -2.85,3.88 | drill 1.2 pad 2 square: M1 -4.32,3.8; M3 4.32,3.8 | drill 1.2 pad 2 octagon: M2 -4.32,0; M4 4.32,0
XT30PW = drill 1.2 pad 2.54 octagon: M1 -5.5,0; M2 5.5,0 | drill 2 pad 4 octagon: N 2.5,-10; P -2.5,-10
1X02_LONGPADS = drill 1.2 pad 1.88 long: 1 0,0; 2 2.54,0
1X06_LOCK = drill 1 pad 1.88 square: 1 0,0 | drill 1 pad 1.88: 2 2.54,-0.354; 3 5.08,0.1; 4 7.62,-0.354; 5 10.16,0.1 | drill 1 pad 1.88 octagon: 6 12.7,-0.354
1X04_LOCK = drill 1 pad 1.88 square: 1 0,0.127 | drill 1 pad 1.88: 2 2.54,-0.127; 3 5.08,0.127; 4 7.62,-0.127
IND_SRP1265A = smd 5 x 5: 1 -5.55,0; 2 5.55,0
IND-KOOLMU-2W = drill 1 pad 2 octagon: 1A -13.5,0; 1B -8.5,0; 2A 13.5,0; 2B 8.5,0 | smd 5 x 2: 1C -11,0; 2C 11,0 | smd 5 x 2 bottom: 1D -11,0; 2D 11,0
IND-KOOLMU = drill 1 pad 2 octagon: 1 8,0; 2 -8,0
LED_LTST-S220KRKT = smd 1.5 x 1: A 1.25,0; C -1.25,0
LED-0603 = smd 0.8 x 0.8: A 0,-0.75; C 0,0.75
PCB-OUTLINE = drill 2.5 pad 4.2: 1 8,67.4; 2 8,4.6; 3 104,67.4; 4 104,4.6
TO247-COMBO = drill 1.5 pad 2.6 square: 1 0,5.44 | drill 1 pad 2 square: 1B 0,3.2 | drill 1.5 pad 2: 2 0,0 | drill 1.5 pad 2.6 octagon: 3 0,-5.44 | drill 1 pad 2 octagon: 3B 0,-3.2
POWERPAK-1212-8 = smd 0.99 x 0.405: 1 -1.435,0.99; 2 -1.435,0.33; 3 -1.435,-0.33; 4 -1.435,-0.99 | smd 0.76 x 0.405: 5 1.55,-0.99; 6 1.55,-0.33; 7 1.55,0.33; 8 1.55,0.99 | smd 1.725 x 2.235: 9 0.558,0
POWERPAK-SO8-X2 = smd 1.27 x 0.61: 1 -2.67,1.905; 2 -2.67,0.635; 3 -2.67,-0.635; 4 -2.67,-1.905 | smd 1.2 x 0.61: 5 2.9,-1.905; 6 2.9,-0.635; 7 2.9,0.635; 8 2.9,1.905 | smd 3.81 x 1.7: 9 0.69,-1.15; 10 0.69,1.15
SOT23-3 = smd 0.8 x 0.9: 1 -0.95,-1; 2 0.95,-1; 3 0,1.1
0805 = smd 0.8 x 1.2: 1 -0.9,0; 2 0.9,0
0603-RES = smd 1.1 x 1: 1 -0.85,0; 2 0.85,0
1206-SJ = smd 2 x 1.8: 1 -1.2,0; 2 1.2,0
SJ_3 = smd 0.635 x 1.27: 1 -0.9,0; 2 0,0; 3 0.9,0
SWITCH-SLW-864574-5A-RA-N-D = drill 0.8 octagon: C 0,0 | drill 0.8 square: L -2,0; R 2,0 | drill 1.2 offset: M1 -4.1,0; M2 4.1,0
SMA = smd 2 x 2: A 2,0; C -2,0
SOD-323 = smd 0.63 x 0.83: 1 -1.15,0; 2 1.15,0
SOD323-R = smd 0.6 x 0.6: A 1.1,0; C -1.1,0
MODULE_102010388_LOCKING = drill 1 square: 1 -7.32,7.62 | drill 1: 2 -7.92,5.08; 3 -7.32,2.54; 4 -7.92,0; 5 -7.32,-2.54; 6 -7.92,-5.08; 7 -7.32,-7.62; 8 7.32,-7.62; 9 7.92,-5.08; 10 7.32,-2.54; 11 7.92,0; 12 7.32,2.54; 13 7.92,5.08; 14 7.32,7.62
SOT95P280X145-6N-7-V = smd 0.8 x 0.5: 1 -1.2,0.95; 2 -1.2,0; 3 -1.2,-0.95; 4 1.2,-0.95; 5 1.2,0; 6 1.2,0.95
DRR0012E-MFG = smd 0.62 x 0.25: 1 -1.39,1.25; 2 -1.39,0.75; 3 -1.39,0.25; 4 -1.39,-0.25; 5 -1.39,-0.75; 6 -1.39,-1.25; 7 1.39,-1.25; 8 1.39,-0.75; 9 1.39,-0.25; 10 1.39,0.25; 11 1.39,0.75; 12 1.39,1.25 | smd 1.3 x 2.5: 13 0,0 | drill 0.3: 14 0,-0.991; 15 0.025,0; 16 0,0.991
QFN3030-16 = smd 0.7 x 0.3: 1 -1.5,0.75; 2 -1.5,0.25; 3 -1.5,-0.25; 4 -1.5,-0.75; 9 1.5,-0.75; 10 1.5,-0.25; 11 1.5,0.25; 12 1.5,0.75 | smd 0.3 x 0.7: 5 -0.75,-1.5; 6 -0.25,-1.5; 7 0.25,-1.5; 8 0.75,-1.5; 13 0.75,1.5; 14 0.25,1.5; 15 -0.25,1.5; 16 -0.75,1.5 | smd 1.7 x 1.7: EXP 0,0

### Placement (x,y rotation side)
C1  46,64.5 270 bottom
C2  36.1,37.3 270 bottom
C3  33.6,37.3 270 bottom
C4  31.1,37.3 270 bottom
C5  28.6,37.3 270 bottom
C6  59.3,27.3 0 bottom
C7  59.3,29.8 0 bottom
C8  59.3,24.8 0 bottom
C9  69,27.3 180 bottom
C10  103.8,36 0 bottom
C11  103.8,33.5 0 bottom
C12  59.2,45.5 90 top
C13  69,51.6 270 top
C14  46,55.6 270 bottom
C15  59.9,62.4 0 bottom
C16  65,55.7 90 bottom
C17  18,4.53 180 bottom
C18  60.3,66.6 0 bottom
C19  60.3,64.6 0 bottom
C20  8.3,53.4 180 bottom
C21  21.1,53.04 180 bottom
C22  7.9,32.3 180 bottom
C23  77.9,51.9 270 bottom
C24  19.6,49 0 bottom
C25  23.9,55.1 90 bottom
C26  23.9,51.9 90 bottom
D1  53.7,61.6 180 bottom
D2  70.2,57.3 0 bottom
D3  37.5,58 90 bottom
D4  32,58 270 bottom
F1  24,68 270 top
FAN1  22.3,5.8 180 top
IC1  50,56.5 90 top
IC2  59,56.5 90 bottom
JP1  109.8,36 270 bottom
JP2  2.6,40 270 top
JP3  2,53 90 top
JP4  104,47 90 top
JP5  2.2,20.4 270 top
JP6  110,54.4 90 top
L1  33,56 0 top
L2  41,33 0 top
L3  65,19 180 top
L4  82,36 180 top
L5  99,25 0 top
LED1  110.8,42.2 90 bottom
LED2  111,41.3 180 top
PCB1  0,0 0 top
PCB2  44.5,4.9 0 bottom
Q1  46,68.8 90 top
Q2  16.3,51.3 0 top
Q3  19.6,54.4 270 top
Q4  15,40 0 top
Q5  19.6,46.7 90 top
Q6  22,39.9 0 bottom
Q7  27.8,2.9 270 bottom
R1  64,68.3 0 bottom
R2  64,66.2 0 bottom
R3  55.8,68.1 0 bottom
R4  55.8,70.2 0 bottom
R5  108.4,50.9 270 bottom
R6  110.4,50.9 270 bottom
R7  22,37.2 180 bottom
R8  22,33 180 bottom
R9  13.4,34.9 270 bottom
R10  10.7,34.1 180 bottom
R11  10.7,36.1 0 bottom
R12  22.8,49 0 bottom
R13  12.4,23 0 bottom
R14  9,21.3 0 bottom
R15  16.4,27.3 270 bottom
R16  16.4,23.9 270 bottom
R17  21.2,27.3 270 bottom
R18  21.2,23.9 270 bottom
R19  18.8,27.3 270 bottom
R20  18.8,23.9 270 bottom
R21  73.5,49.1 0 bottom
R22  76,51.9 90 bottom
R23  107.2,56.9 180 bottom
R24  107.1,59.5 180 bottom
R25  97.2,49.5 180 bottom
R26  93.1,67.4 90 bottom
R27  28.8,6.4 90 bottom
R28  28.8,9.9 90 bottom
R29  21.5,56 180 bottom
R30  16.8,59.3 0 bottom
R31  20,59.3 180 bottom
R32  20,61.2 180 bottom
SJ1  55.4,68.8 180 top
SJ2  110.3,30 270 top
SJ3  110.3,30 270 bottom
SJ4  108.4,42 90 top
SJ5  108.4,42 90 bottom
SJ6  24.6,9.6 90 bottom
SJ7  24.6,2 90 bottom
SW1  110,12 270 top
TVS1  6,50.5 0 bottom
TVS2  8.3,39.4 0 bottom
TVS3  22,35.2 0 bottom
TVS4  104.8,55.8 270 bottom
TVS5  104.7,60.6 90 bottom
TVS6  94.6,48.4 270 bottom
U1  88,62 270 top
U2  60,69.5 180 bottom
U3  17.3,54.2 180 bottom
U4  13,29.8 0 bottom

### Tracks (layer width: path | path; a pad name or v marks a point on that pad's centre or on a via)
5V
  Bottom 0.813: D2.A 65.05,57.3 C16.A
  Bottom 1: IC2.2 IC2.4 | 65,57.3 C16.A
  Bottom 1.5: C16.A 62.1,57.35 IC2.4
12V-2
  Bottom 1: D1.A 51.55,59.04 IC1.3
+12V  (via drill 0.3, 1 pad 1.8)
  Top 1: v53,42 29,42 24,37 24,12.3 25.3,11 25.3,5.56 24.27,4.53 FAN1.V
  Bottom 0.406: U2.1 58.8,67.25 C18.2
  Bottom 0.6: C18.2 C19.2
  Bottom 0.61: C19.2 59.45,63.6 C15.A
  Bottom 0.813: v55,64 55,62.45 D1.C
  Bottom 1: v53,42 53,57.6 54.21,58.81 IC2.3 55.9,61.6 D1.C 56.65,62.4 C15.A | FAN1.V C17.A
+24V
  Top 1.5: 28.6,55.9 33.5,51 43,51 45.96,53.96 IC1.1 53.28,53.96 C12.1 68,48.04 C13.1
  Bottom 0.406: C13.1 72.65,49.06 R21.2
  Bottom 0.61: C13.1 69.8,49.86 C13.1B
  Bottom 1: C14.A IC1.1
  pour Top (isolate 0.203, rank 3, no thermals): 26.5,55.9 26.5,68.2 36.4,68.2 29.8,61.6 29.8,55.9
  pour Top (isolate 0.203, rank 2, no thermals): 53.6,54.5 45.8,54.5 42.9,51.6 33.8,51.6 28,57.4 25.1,57.4 25.1,53.9 32,47 59.5,47 59.5,48.6
ADC  (via drill 0.3)
  Top 0.406: U1.3 v90.54,65 | v82.92,59.3 U1.9
  Bottom 0.406: U1.9 82.92,51.5 82.12,50.7 78.5,50.7 77.9,50.7 | v82.92,59.3 88.62,65 v90.54,65 | R21.1 74.6,49.1 75.7,50.2 75.7,50.75 R22.1 76,50.7 77.9,50.7 | C23.2 77.9,50.7
DC-SRC  (via drill 0.3, 2 pad 4)
  Top 0.203: v21.74,54.46 21.74,54.8
  Top 0.305: 18.6,49.26 20.58,49.26
  Top 0.35: Q5.8 18.6,49.26 | 20.58,49.26 Q5.5 | 19.26,47.92 19.26,49.34 | 19.94,47.88 19.94,49.3 | 21.68,46.6 20.56,46.6
  Top 0.406: 18.61,48.5 18.61,48.48 | 20.6,48.5 21.2,48.5
  Bottom 0.203: U3.9 v21.74,54.45 v21.74,54.46
  other vias: 16.6,65.7 17.2,65.7 17.8,65.7 18.4,65.7 13.9,63.8
  pour Top (isolate 0.305, rank 2, no thermals): 22,61.1 13.4,61.1 11.9,62.6 11.9,68 14.4,69.5 20.78,69.5 22,68.28
  pour Bottom (isolate 0.254, rank 2, no thermals): 11.9,68.8 11.9,65.5 19.98,65.5 21.6,67.12 21.6,68.8
  pour Top (isolate 0.305, rank 4): 18.5,46.6 18.5,57 12.2,63.3 12.2,65 22,65 22,59 23.4,57.6 23.4,48 22,46.6
  pour Top (isolate 0.203, rank 2, no thermals): 19.16,55.6 19.16,56.6 19.44,56.88 21.12,56.88 21.12,55.46 19.16,55.46
FAN  (via drill 0.3)
  Top 0.406: v84.8,48.2 81.5,48.2 78,51.7 78,64 80.38,66.38 U1.7
  Bottom 0.406: v84.8,48.2 84.8,3 83.3,1.5 31.8,1.5 31.3,2 31.3,6.49 30.54,7.25 R27.2
  Bottom 0.61: SJ6.3 25.6,10.5 27.1,9 28.75,9 R28.1 R27.2
FET-GATE
  Bottom 0.203: Q1.1B 45,71 54.15,71 R4.2
  Bottom 0.406: R3.2 R4.2
  Bottom 0.813: Q1.1B Q1.1
GND  (via drill 0.3, 2 pad 4)
  Top 0.406: 55.8,70.1 55.8,67.4 | 57.3,68.2 58.1,67.4 | 57.3,69.4 58.1,70.2 | 109,29.6 111.5,29.6 | 109,28 111.4,28 | 107.1,44 109.6,44 | 107,42.4 109.5,42.4
  Top 0.6: 12.4,55.4 12.5,55.5 | 12.5,55.5 v14,57 | 12.5,55.5 v14,54
  Top 0.813: SW1.R SW1.M2
  Top 1.016: 14.2,55.5 12.5,55.5 JP3.N | JP3.N 9.6,55.5 | JP3.N 12,58.2
  Bottom 0.203: 15.44,30.06 13.2,30.06 13,29.86 U4.EXP | 15.42,29.56 13.46,29.56 | 12.26,27.5 12.26,29.2
  Bottom 0.406: 111.5,29.6 109,29.6 | 111.5,28 109,28 | 109.7,42.4 107.1,42.4 | 109.7,44 107,44 | 30.8,55 29.5,56.3 | 34.5,56.3 33.2,55 | 30.7,53.5 29.4,52.2 | 33,53.8 34.3,52.5
  Bottom 0.6: 12.4,55.5 14,57.1 v14,58 | JP3.N 12.5,55.5 v14,54
  Bottom 0.813: SW1.R 110,8
  Bottom 1.016: 9.4,55.5 JP3.N | JP3.N 12.4,55.5 13.4,55.5 | 12,57.9 JP3.N
  other vias: 26.8,37.3 38,37.3 40,39 42.4,53 34.9,52.3 34.9,55 34.9,57 34.9,59 38.7,59.3 39.5,60.4 41.6,62.4 43.5,64.3 44.7,55.7 48.3,61 48.3,64 38.8,70.6 37,68 35,65 25.4,66 25.4,64 22.8,62 22.8,65 25.4,61 24.6,50 10,43 9,35.1 6,32.3 9.7,28 15.4,26 15.7,29.8 15.1,33 16.6,33.7 16.6,32.3 20,37.2 20,35.2 20,32.3 20,38.9 28.2,44.7 26.1,42.5 30.6,56.2 23,14 25,14 23,19 25,19 25,24 23,24 25,29 23,29 16.4,3.1 16.4,5.9 14.9,4.5 35,30 39,32 39,35 104.1,31.7 104,37.8 102.1,38 102.7,31.7 100.8,29.8 98.8,27.8 96.7,25.7 94.7,23.7 92.8,23 89.5,23.4 88,26 88,28 88,30 88,32 87.8,34 87.8,36 90,38.2 92,38 94,38 96,38 98,38 100,38 106,52.8 106,51.2 102,51.2 102,52.8 98,51.2 98,52.8 81.6,67.8 81.6,66.2 76,69 76,67.6 72,69 72,67.6 68,69.4 68,67.2 70,66.2 62.2,69.3 62.1,67.6 62.3,64.6 63,62.4 63.5,54 65,52.5 57.7,54.2 54.3,55.3 54.4,57.5 54.6,60.3 67,56.3 67,58.3 75,58.3 75,56.3 78.8,56.3 78.8,58.3 87,56.3 87,58.3 91,56.3 91,58.3 95,58.3 97,56.3 59,58 59,55 76.2,34 76,31 76,28 76,25 76,22 75.8,19 74.6,17 71.4,17 70.4,18.9 69.5,22 69.5,25 68.8,25.8 68.8,28.9 66.3,27.3 67.6,25.9 67.6,28.7 69.4,31 70.2,34.2 72.2,37.8 75.8,37.8 62,29.8 62,27.3 62,24.8 60.7,23.3 60.7,31.2 47.2,33 47.6,30 47.6,27 48.7,23.8 51.2,21.3 53.7,18.8 57,16.7 59.2,20 58.9,22.8 49.5,35.1 53,35.1 56,35.1 58,32.2 106.3,71.3 111.3,66.3 111.3,5.7 106.3,0.7 111.3,25 5.7,0.7 0.7,5.7 41,0.6 49,0.7 65,0.7 82,0.7 95,0.7 0.7,28 0.7,33 0.7,66.3 5.7,71.3 24,71.3 35,71.3 61.2,71.3 68,71.3 76,71.3 98,71.3 94,51.2 90,51.2 87,53 25.8,1.1 74.6,45 89.4,45 89,13 82,19.4 91,41 99,41.4 106.3,41.3 99,8.6 106.3,8.7 65,35.4 65,2.6 72.4,2.6 57.6,2.6 57.6,10 72.4,10 57.6,35.4 53.9,16.6 41,16.6 28.1,24 66,49.3 71,49.8 71,48.3 61,49.3 76,54 60,70.5 60,69.8 60,69.1 60,68.4 62.2,69.9 62.2,70.5 62.2,71.1 107,26.6 107,23.4 105.4,25 108.6,25 23,31.6 24,39 82.2,58.3 83.6,58.3 83.6,56.3 82.2,56.3 25,31.6 7.6,42.7 8.2,42.7 7.6,37.3 86.5,61.9 85.5,62.9 83.8,61.3 84.9,60.2 91.8,66.2 99,59.6 99,62.9 51.4,66.9 50,66.9 48.7,66.9 106.9,42.4 106.9,43.2 106.9,44 108.4,44.7 110.3,27.3 108.8,28 108.8,28.8 108.8,29.6 13,8.9 17.3,19.4 18.5,18.2 19.6,14.2 20.8,13 22,18 20.3,18 19.9,27.3 17.7,27.3 52.8,62.1 44,46.3 31,47 28,50 47,46.3 50,46.3 51.9,46.3 54.3,46.3 57,46.3 42.4,46.3 42.4,43 44,43 47,43 50,43 52,43 54.3,43 52,40.9 50,40.9 47,40.9 44,40.9 42,40.9 28.2,16.7 97,48.4 93.6,48.8 90,48.8 11.4,28.2 11.4,31.4 14.6,31.4 14.6,28.2 9.2,29.9 99,48.4 84,36 84,32 84,28 84,24 85.7,40 88,39 88,41 88,24 84,20 87,20 89,11 93,11 97,11 101,11 105,11 93,13 97,13 101,13 105,13 94,41 96,41 97,43 99,43 99,45.5 97,45.5 106.2,28 107,28 107.8,28 84,16 87,16 87,13 85.7,12 87,22 48.2,70.2 50,70.3 64,69.5 66,66.2 56.6,67.1 56.6,66 57.7,67.1 57.7,66 55.8,71.4 58,71.4 84,40 23.4,1.1 29.8,1.9 28.8,1 30.3,6 31.5,7.4 32.1,2.3 32.1,0.7 41,2.3 49,2.3 57.6,0.7 72.4,0.7 82,2.3 84,5 85.6,5 84,12 17.7,29 19.9,29 84,44 85.7,44 43.3,70.4 32,56.2 6,62 66,46.8 61,46.8 76.5,49.9 17.8,56 17.8,56.7 15.78,56.6 16.3,57.14 16.86,57.68 24,58.7 14.76,53 14.44,49.28 13.12,52.98 17.3,49.3 17.3,47.9 14,60.3 14,59.2 22.8,59.4 24.3,57.1 24.6,48 25.9,48 25.8,50 24,45.5 24.9,44.6 22.7,42.3 21.3,42.3 17.3,46 16.6,36.4 111.4,49.4 111.4,52.4 89,64.2 89,65.8 87.2,64.8 87.9,63.1 77.2,58.3 77.2,56.3 79.1,66.2 79.6,67.8 83.7,66.2 83.7,67.8 79.2,52.7 81.2,52.7 84,52.7 85.5,48.7 80.9,49.9 84,47.4 82.9,50.4 78.7,49.9 79.5,51.5 87.1,50.3 87.1,48.7 85.6,47.4
  pour Top (isolate 0.203, rank 6): 0.1,0 112,0 112,72 0,72 0,0
  pour Bottom (isolate 0.203, rank 6): 0,0 112,0 112,72 0,72
LED
  Bottom 0.406: U1.11 88,52.6 88.6,52 110.4,52 R6.1 R5.1
M1
  Top 0.813: L2.1A L2.1D
  Bottom 0.813: L2.1B 32.6,33 | L2.1B 36.6,33 | L2.1B L2.1D L2.1A
  pour Bottom (isolate 0.61, rank 3): 26.5,32 38,32 38,36.1 26.5,36.1
  pour Bottom (isolate 0.203, rank 2, no thermals): 26.5,34.7 26.5,32 34.2,32 34.2,34.7
M2  (via drill 0.3)
  Top 0.813: L2.2B L2.2D
  Bottom 0.813: 49.4,33 L2.2B L2.2D
  other vias: 56.3,21.8 57,21.8 57.7,21.8
  pour Bottom (isolate 0.61, rank 3, no thermals): 49.1,33.9 54.9,33.9 57.9,30.9 57.9,18.6 57.4,18.1 55.9,18.1 48.6,25.4 48.6,33.4
  pour Top (isolate 0.813, rank 3, no thermals): 56.1,18.1 56.1,22 57.9,22 57.9,18.1
M3  (via drill 0.3)
  other vias: 72.3,21.8 73,21.8 73.7,21.8 73.3,33.1 74,33.1 74.7,33.1
  pour Bottom (isolate 0.61, rank 3, no thermals): 72.1,18.6 72.6,18.1 73.4,18.1 74.9,19.6 74.9,36.4 74.4,36.9 73.6,36.9 73.1,36.4 73.1,36.3 73.1,35.6 70.5,33 70.5,28.1 69.6,28.1 69.6,26.5 70.5,26.5 70.5,20.2
  pour Top (isolate 0.813, rank 3, no thermals): 72.1,18 73.9,18 73.9,22 72.1,22
  pour Top (isolate 0.813, rank 3, no thermals): 73.1,32.9 74.9,32.9 74.9,36.9 73.1,36.9
M4  (via drill 0.3)
  other vias: 90,33.2 89.3,33.2 90.7,33.2 91,27.8 90.3,27.8 91.7,27.8
  pour Bottom (isolate 0.61, rank 3, no thermals): 90.6,24.1 93.6,24.1 102.2,32.7 102.2,36.9 89.7,36.9 89.1,36.3 89.1,25.6
  pour Top (isolate 0.813, rank 3, no thermals): 89.6,36.9 89.1,36.4 89.1,33 90.9,33 90.9,36.9
  pour Top (isolate 0.813, rank 3, no thermals): 90.6,24.1 90.1,24.6 90.1,28 91.9,28 91.9,24.1
MCU-RF
  Bottom 0.406: U2.6 63.1,68.55 R1.2 63.1,66.25 R2.2
MOSFET-DRAIN  (via drill 0.3)
  Bottom 1.016: D3.A 37.5,54.1 v37.6,54
  Bottom 1.5: C1.1 Q1.2
  other vias: 36.2,54 36.9,54 38.3,54 39,54 39.7,54 40.4,54
  pour Bottom (isolate 0.61, rank 3): 26.6,38.4 38,38.4 41.3,41.7 41.3,54.5 36,54.5 36,50.4 26.6,41
  pour Top (isolate 0.61, rank 3, no thermals): 36.2,56.2 36.2,54.5 35.9,54.2 35.9,53.7 40.4,53.7 47.2,60.5 47.2,69.5 46.6,70.1 45.4,70.1 44.8,69.5 44.8,64 37,56.2
  pour Bottom (isolate 0.61, rank 3, no thermals): 45.2,65.5 46.8,65.5 46.8,67.8 47.3,68.3 47.3,69.4 46.6,70.1 45.4,70.1 44.7,69.4 44.7,68.3 45.2,67.8
MOSFET-SOURCE
  Top 2: Q1.3B Q1.3 SJ1.2
  Bottom 2: Q1.3B 51.5,68.8
N$2
  Bottom 0.406: R17.2 R18.1
N$8  (via drill 0.3)
  Top 0.406: LED2.A 111,48.7 v110.6,49.1
  Bottom 0.406: R6.2 110.6,49.75 v110.6,49.1
N$9
  Bottom 0.406: R15.2 R16.1
N$10
  Bottom 0.305: R13.2 R14.1
N$13
  Bottom 0.406: R19.2 R20.1
N$14
  Bottom 0.406: U2.2 58,69.5 56.75,68.25 R3.1
N$15
  Bottom 0.406: U2.3 56.9,70.45 R4.1
N$16  (via drill 0.3)
  Top 0.406: v10.8,41.9 Q4.1
  Bottom 0.203: v10.8,41.9 9,41.9 8.3,41.2 8.3,38 8.8,37.5 10.6,37.5 11.3,36.8 11.3,36.1 R11.1
  pour Top (isolate 0.203, rank 2, no thermals): 12.8,41.7 12.8,43.28 13.12,43.6 19.6,43.6 20,44 20,45.6 18.5,45.6 18.5,45.3 11.2,45.3 10.8,44.9 10.8,41.7
N$17
  Bottom 0.406: JP6.2 108.09,56.94 R23.2
N$18
  Bottom 0.406: JP6.3 107.97,59.48 R24.2
N$19
  Bottom 0.61: R27.1 Q7.1
N$20
  Bottom 0.61: SJ6.2 FAN1.P
N$21
  Bottom 0.406: JP4.2 98.19,49.54 R25.2 98.05,41 97.05,40 87,40 86,39 86,13 87,12 SW1.C
N$22
  Bottom 0.61: Q7.3 SJ7.3 SJ6.1
N$23
  Bottom 0.813: D2.C 94.92,57.3 95.62,56.6 U1.14
N$24
  Bottom 0.61: FAN1.G SJ7.2
N$25
  Bottom 1.016: D3.C 33.55,60.15 D4.C
N$29
  Bottom 0.406: C25.1 C26.2
N$30
  Bottom 0.203: R7.2 22.95,37.2 | TVS3.1 22.95,35.2 22.95,35.3
  Bottom 0.6: Q6.1 22.95,37.2 22.95,35.3 22.95,33 R8.2
N$35  (via drill 0.3)
  Top 0.203: Q4.8 15.69,41.91 Q4.10 15.69,40.63 Q4.7 | 15.7,39.37 15.69,39.37 Q4.9 15.14,38.3 v14.4,38.3 | Q4.6 17.2,39.37 | 17.2,39.37 15.7,39.37 | 15.7,39.37 15.7,39 | Q4.5 17.2,38.09 17.2,39.37
  Bottom 0.203: v14.4,38.3 14.4,33.3 13.75,32.65 U4.16
  pour Top (isolate 0.203, no thermals): 14.5,41.8 14.5,38.2 17.1,38.2 17.1,41.8
N$38
  Bottom 0.203: C22.2 8.95,32.5 | U4.13 12.25,32.2 11.95,32.5 11.5,32.5
  Bottom 0.305: 11.5,32.5 10.8,32.5
  Bottom 0.406: 8.95,32.5 10.8,32.5
N$40
  Bottom 0.203: R10.2 11.6,34 12.75,32.85 U4.14
N$43
  Bottom 0.406: R29.2 23.85,56 C25.2
N$46
  Bottom 0.254: R5.2 110.8,47.65 LED1.A
N$57
  Bottom 0.406: R10.1 R11.2
N$68
  Bottom 0.203: U3.4 14.91,54.45 14.7,54.66 14.7,58.05 R30.2
N$69
  Bottom 0.254: U3.11 19.84,53.45 C21.1
PWR-DIS  (via drill 0.3)
  Top 0.406: v86.26,49.5 82.6,49.5 80.38,51.72 U1.8
  Bottom 0.406: R25.1 TVS6.C v86.26,49.5
RF-GEN
  Bottom 0.406: R1.1 77.7,68.3 79,67 92.1,67 92.6,66.5 R26.1
RF-GEN-PRE
  Bottom 0.406: R26.2 93.1,69.9 U1.2
RF-OUT
  pour Bottom (isolate 0.61, rank 3, no thermals): 111.5,36.8 104.5,36.8 104.5,32.7 105.9,32.7 105.9,35.2 111.5,35.2
RF-RETURN  (via drill 0.3)
  Top 1: SJ4.1 108.4,38.83 JP1.2_1 | SJ2.1 110.3,33.17 JP1.3_1
  Top 2: JP1.3_1 JP1.2_1
  Bottom 1: SJ4.1 108.4,38.83 JP1.2_1 | SJ2.1 110.3,33.17 JP1.3_1
  other vias: 108.4,40.8 110.3,31.2
SEL2  (via drill 0.3)
  Top 0.406: U1.6 82.92,63.4 85.92,60.4 100.1,60.4 v103.6,56.9
  Bottom 0.406: R23.1 TVS4.C v103.6,56.9
SEL3  (via drill 0.3)
  Top 0.406: U1.4 88,64.1 90,62.1 101,62.1 v103.6,59.5
  Bottom 0.406: R24.1 TVS5.C v103.6,59.5
U3-DGATE  (via drill 0.3)
  Top 0.254: Q2.4 15.2,50.31 v15.2,49.6
  Bottom 0.254: v15.2,49.6 15.2,52.24 U3.1
U3-EN
  Bottom 0.203: U3.6 16.1,55.45 16.1,56.1 18,58 24.5,58 25.2,57.3 25.2,49 | R12.1 25.2,49 | 25.2,49 25.2,45.8 22,42.6 Q6.3
U3-HGATE  (via drill 0.3)
  Top 0.203: v18.61,57 Q3.4
  Bottom 0.203: U3.8 20.09,54.95 20.3,55.16 20.3,56 | v18.61,57 20.1,57 20.3,56.8 20.3,56.6 20.3,56 | R29.1 20.3,56
U3-OV
  Bottom 0.203: U3.5 15.2,54.95 15.2,56.85 R30.1
  Bottom 0.406: R30.1 R31.1 R32.1
U4-VGA
  Bottom 0.203: U4.15 13.25,33.9 R9.2
U4-VGA-2  (via drill 0.3)
  Top 0.152: Q4.2 13.38,40.63 | 13.38,40.63 13.38,38.23 13.25,38.09 12.7,38.09 Q4.4 | 14.4,43.1 13.7,43.1 13.38,42.78 13.38,40.63
  Top 0.203: 14.9,43.1 14.4,43.1
  Top 0.254: Q5.4 20.59,43.5 20.19,43.1 14.9,43.1
  Top 0.406: v13.4,36.8 12.7,37.5 12.7,38.09
  Bottom 0.406: R9.1 v13.4,36.8
U4-VSEL
  Bottom 0.3: U4.4 15.5,29.05 R15.1
  Bottom 0.406: R15.1 R19.1 R17.1
USB-CC1  (via drill 0.8 pad 1.42)
  Top 0.152: JP2.A5 5.3,40.5 | 5.3,40.5 5,40.5 4.2,39.7 v4.2,29.2 | 5.3,40.5 6.2,40.7 | 5.3,40.5 6.2,40.3
  Bottom 0.203: v4.2,29.2 9.4,29.2 10.35,30.05 U4.11
USB-CC2  (via drill 0.3)
  Top 0.152: JP2.B5 5.3,39.5 | 5.3,39.5 5,39.5 4.6,39.1 4.6,32 v5.1,31.5 | 5.3,39.5 6.1,39.7 | 5.3,39.5 6.1,39.3
  Bottom 0.203: v5.1,31.5 6.05,30.55 U4.12
USB-I-SEL
  Bottom 0.305: U4.5 13.75,23 | 13.75,23 13.75,22.15 11.9,20.3 2.3,20.3 JP5.1 | R13.1 13.75,23
USB-V-SEL-20V
  Bottom 0.406: R18.2 21.2,14.58 19.22,12.6 9.9,12.6 5,7.7 JP5.6
USB-V-SEL-28V
  Bottom 0.406: R20.2 18.8,19.66 16.14,17 10.9,17 6.68,12.78 JP5.4
USB-VBUS  (via drill 0.3)
  Top 0.6: JP2.B9 7.7,41.52 7.7,38.48 JP2.A9
  Bottom 0.203: 11,40 v11,38.5 10.3,38.5 TVS2.C | U4.1 15.45,30.55 15.8,30.9 15.8,31.6
  Bottom 0.305: 15.8,31.6 15.8,33 | 15.8,33 15.8,39.39 15.19,40 11,40 | R8.1 15.8,33
  pour Top (isolate 0.203, no thermals): 7.5,38.3 11.1,38.3 11.5,38.7 11.54,38.74 12.86,38.74 12.86,39.46 12.86,40.02 12.04,40.02 11.48,40.02 11,40.5 9.8,41.7 7.5,41.7
VCD  (via drill 0.3)
  Top 0.254: v19,52 19.27,52 Q3.6
  Bottom 0.254: U3.10 21.04,53.95 C21.2 | U3.12 18.69,52.31 v19,52
  Bottom 0.406: 22,53 21.95,53 | 21.95,52 R12.2 C24.1 | v19,52 21.95,52 | 21.95,52 21.95,53 | C21.2 21.95,53
  pour Top (isolate 0.203, rank 2, no thermals): 16.7,52.3 18.1,52.3 18.6,52.8 18.6,54 20.6,54 20.6,52.8 20.1,52.8 20.1,50.8 17.9,50.8 17.9,50.3 16.7,50.3
VIN-XT30  (via drill 0.3)
  Top 0.4: 14.2,50.97 12,50.97 JP3.P 12.5,50.5 12.5,51.63
  Top 0.6: 13,51.8 JP3.P | 13,50.53 JP3.P | 13,49.27 JP3.P | v13.9,52.7 13.9,51.5
  Bottom 0.203: U3.2 15.2,53.45 15.2,53.95 | v13.9,52.7 13.9,53 14.85,53.95 15.2,53.95 | U3.3 15.2,53.95
  Bottom 0.6: C20.1 7.45,50.5 8.5,50.5
  Bottom 1: TVS1.C 8.5,50.5 JP3.P
  pour Top (isolate 0.203, no thermals): 11.6,52.4 16.1,52.4 16.1,51.8 13.4,49.1 11.6,49.1

### Text on the board
tPlace: SPORT | ECO | 5A | 3A | 28V | 20V | FAN+POS | FAN-NEG
tNames: PWR-DIS
bNames: PWR-DIS